# EAGLE design PlacaCalefactora_notUsed (EAGLE 9.6.2)
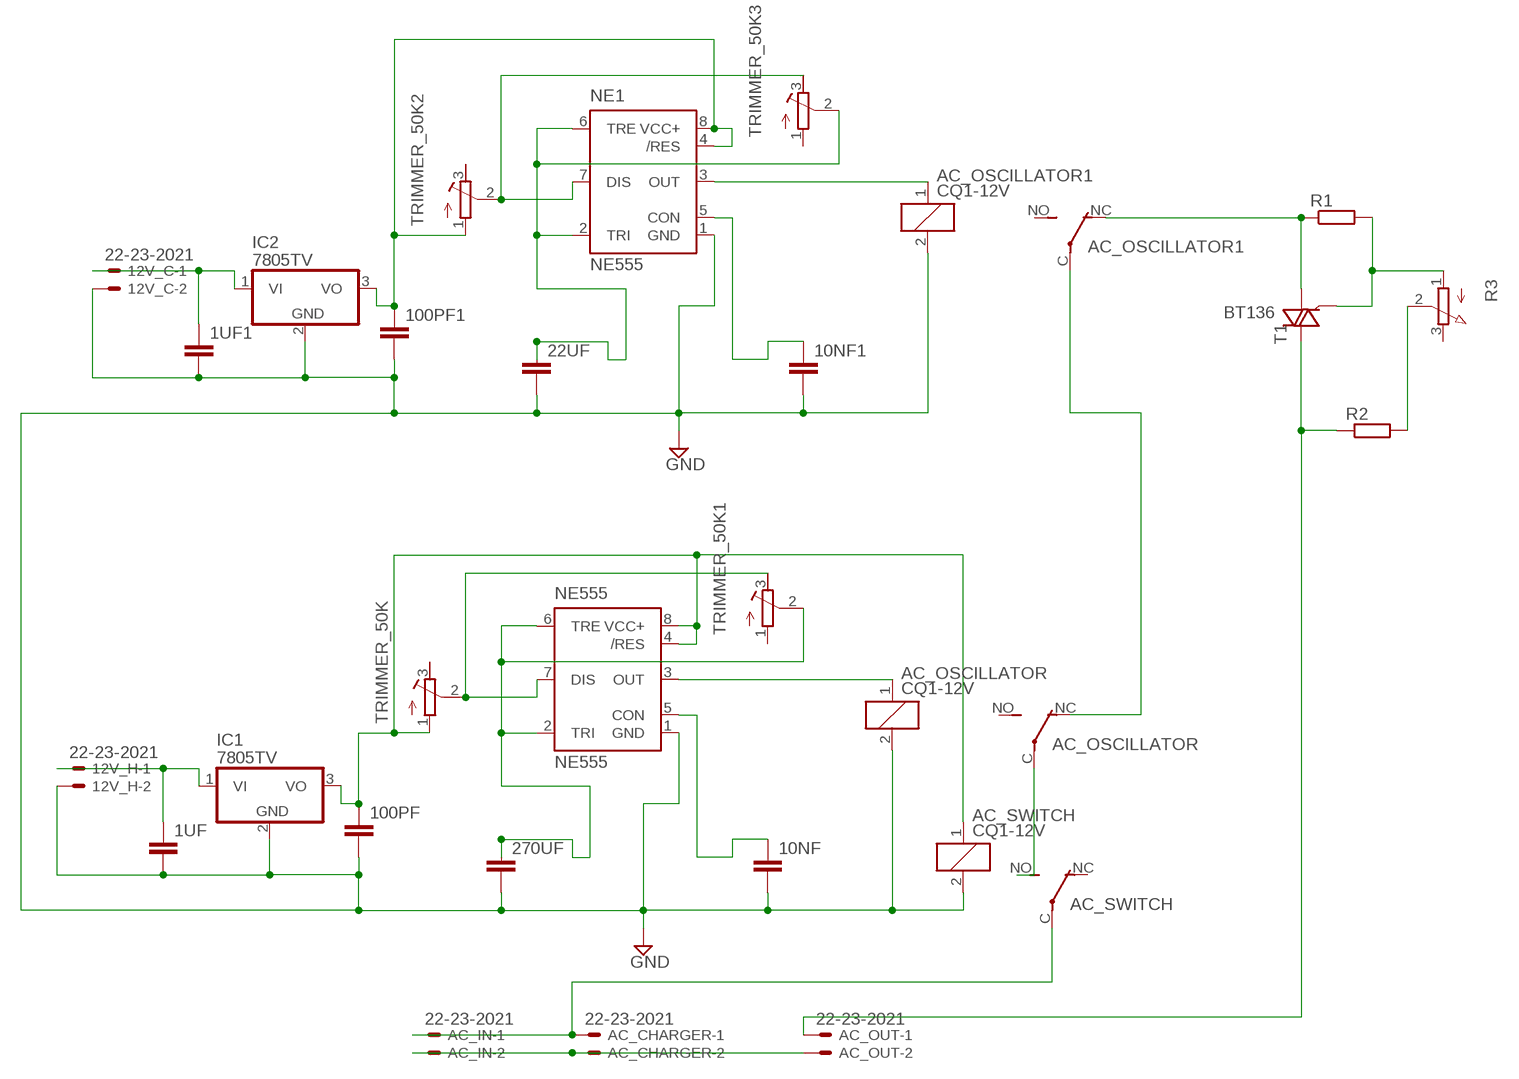
[diagram p0: schematic, sheet 1]

## Parts
1UF  C7.5/3  [C7.5B3]
1UF1  C7.5/3  [C7.5B3]
10NF  C7.5/3  [C7.5B3]
10NF1  C7.5/3  [C7.5B3]
12V_C  22-23-2021  [22-23-2021]
12V_H  22-23-2021  [22-23-2021]
22UF  C7.5/3  [C7.5B3]
100PF  C7.5/3  [C7.5B3]
100PF1  C7.5/3  [C7.5B3]
270UF  C7.5/3  [C7.5B3]
AC_CHARGER  22-23-2021  [22-23-2021]
AC_IN  22-23-2021  [22-23-2021]
AC_OSCILLATOR  CQ1-12V  [CQ1]
AC_OSCILLATOR1  CQ1-12V  [CQ1]
AC_OUT  22-23-2021  [22-23-2021]
AC_SWITCH  CQ1-12V  [CQ1]
IC1  7805TV  [TO220V]
IC2  7805TV  [TO220V]
NE1  NE555  [DIL-08]
NE555  NE555  [DIL-08]
R1  R-EU_0204/7  [0204/7]
R2  R-EU_0204/7  [0204/7]
R3  3RP/1610N  [3RP/1610N]
T1  BT136  [TO220AB]
TRIMMER_50K  R-TRIMM64W  [RTRIM64W]
TRIMMER_50K1  R-TRIMM64W  [RTRIM64W]
TRIMMER_50K2  R-TRIMM64W  [RTRIM64W]
TRIMMER_50K3  R-TRIMM64W  [RTRIM64W]

## Nets
GND: 1UF1.2 1UF.2 10NF1.2 10NF.2 12V_C.2 12V_H.2 22UF.2 100PF1.2 100PF.2 270UF.2 AC_OSCILLATOR1.2 AC_OSCILLATOR.2 AC_SWITCH.2 IC1.2(GND) IC2.2(GND) NE1.1(GND) NE555.1(GND)
N$1: AC_CHARGER.1 AC_IN.1 AC_SWITCH.C(2:P)
N$2: AC_CHARGER.2 AC_IN.2 AC_OUT.2
N$3: 10NF1.1 NE1.5(CON)
N$4: AC_OSCILLATOR.1 NE555.3(OUT)
N$5: 10NF.1 NE555.5(CON)
N$6: NE555.7(DIS) TRIMMER_50K1.3(E) TRIMMER_50K.2(S)
N$7: AC_OSCILLATOR.C(2:P) AC_SWITCH.NO(2:S)
N$8: AC_OSCILLATOR1.C(2:P) AC_OSCILLATOR.NC(2:O)
N$9: 1UF.1 12V_H.1 IC1.1(VI)
N$10: 270UF.1 NE555.2(TRI) NE555.6(TRE) TRIMMER_50K1.2(S)
N$11: R1.2 R3.1(A) T1.3(G)
N$12: AC_OSCILLATOR1.NC(2:O) R1.1 T1.1(A1)
N$13: 100PF.1 AC_SWITCH.1 IC1.3(VO) NE555.4(/RES) NE555.8(VCC+) TRIMMER_50K.1(A)
N$14: 22UF.1 NE1.2(TRI) NE1.6(TRE) TRIMMER_50K3.2(S)
N$15: NE1.7(DIS) TRIMMER_50K2.2(S) TRIMMER_50K3.3(E)
N$16: AC_OSCILLATOR1.1 NE1.3(OUT)
N$17: R2.2 R3.2(S)
N$18: 1UF1.1 12V_C.1 IC2.1(VI)
N$20: AC_OUT.1 R2.1 T1.2(A2)
N$21: 100PF1.1 IC2.3(VO) NE1.4(/RES) NE1.8(VCC+) TRIMMER_50K2.1(A)
Unconnected: AC_OSCILLATOR1.NO(2:S) AC_OSCILLATOR.NO(2:S) AC_SWITCH.NC(2:O) R3.3(E) TRIMMER_50K1.1(A) TRIMMER_50K2.3(E) TRIMMER_50K3.1(A) TRIMMER_50K.3(E)

## Library data of the parts
1UF 1UF1 10NF 10NF1 22UF 100PF 100PF1 270UF = capacitor-wima:C: CAPACITOR naming: grid - package width
12V_C 12V_H AC_CHARGER AC_IN AC_OUT = con-molex:22-23-2021: .100" (2.54mm) Center Header - 2 Pin; MF: MOLEX; MPN: 22-23-2021; OC_FARNELL: 1462926; OC_NEWARK: 25C3832
AC_OSCILLATOR AC_OSCILLATOR1 AC_SWITCH = relay:CQ1-12V: AUTOMOTIVE QUIET RELAY NAiS Source: http://www.mew-europe.com/.. en_ds_61208_0000.pdf; OC_FARNELL: unknown; OC_NEWARK: unknown
IC1 IC2 = linear:78*: Positive VOLTAGE REGULATOR Source: http://cache.national.com/ds/LM/LM78L05.pdf http://www.fairchildsemi.com/ds/LM/LM7805.pdf
NE1 NE555 = st-microelectronics:NE555: General purpose bipolar Timer; MF: Arrow Electronics; MPN: NE555N; OC_FARNELL: 1467742; OC_NEWARK: 89K1486
R1 R2 = rcl:R-EU_: RESISTOR, European symbol; SPICEPREFIX: R
R3 = pot:3RP/1610N: 16mm Potentiometer one level Source: http://www.alphapotentiometers.net/html/16mm_pot_2.html
T1 = triac:BT136: Triac BT136 series E sensitive gate Source: http://www.nxp.com/acrobat_download/datasheets/BT136_SERIES_E_2.pdf
TRIMMER_50K TRIMMER_50K1-TRIMMER_50K3 = rcl:R-TRIMM: Trimm resistor; SPICEMODEL: X; SPICEPREFIXL: POT

## Board
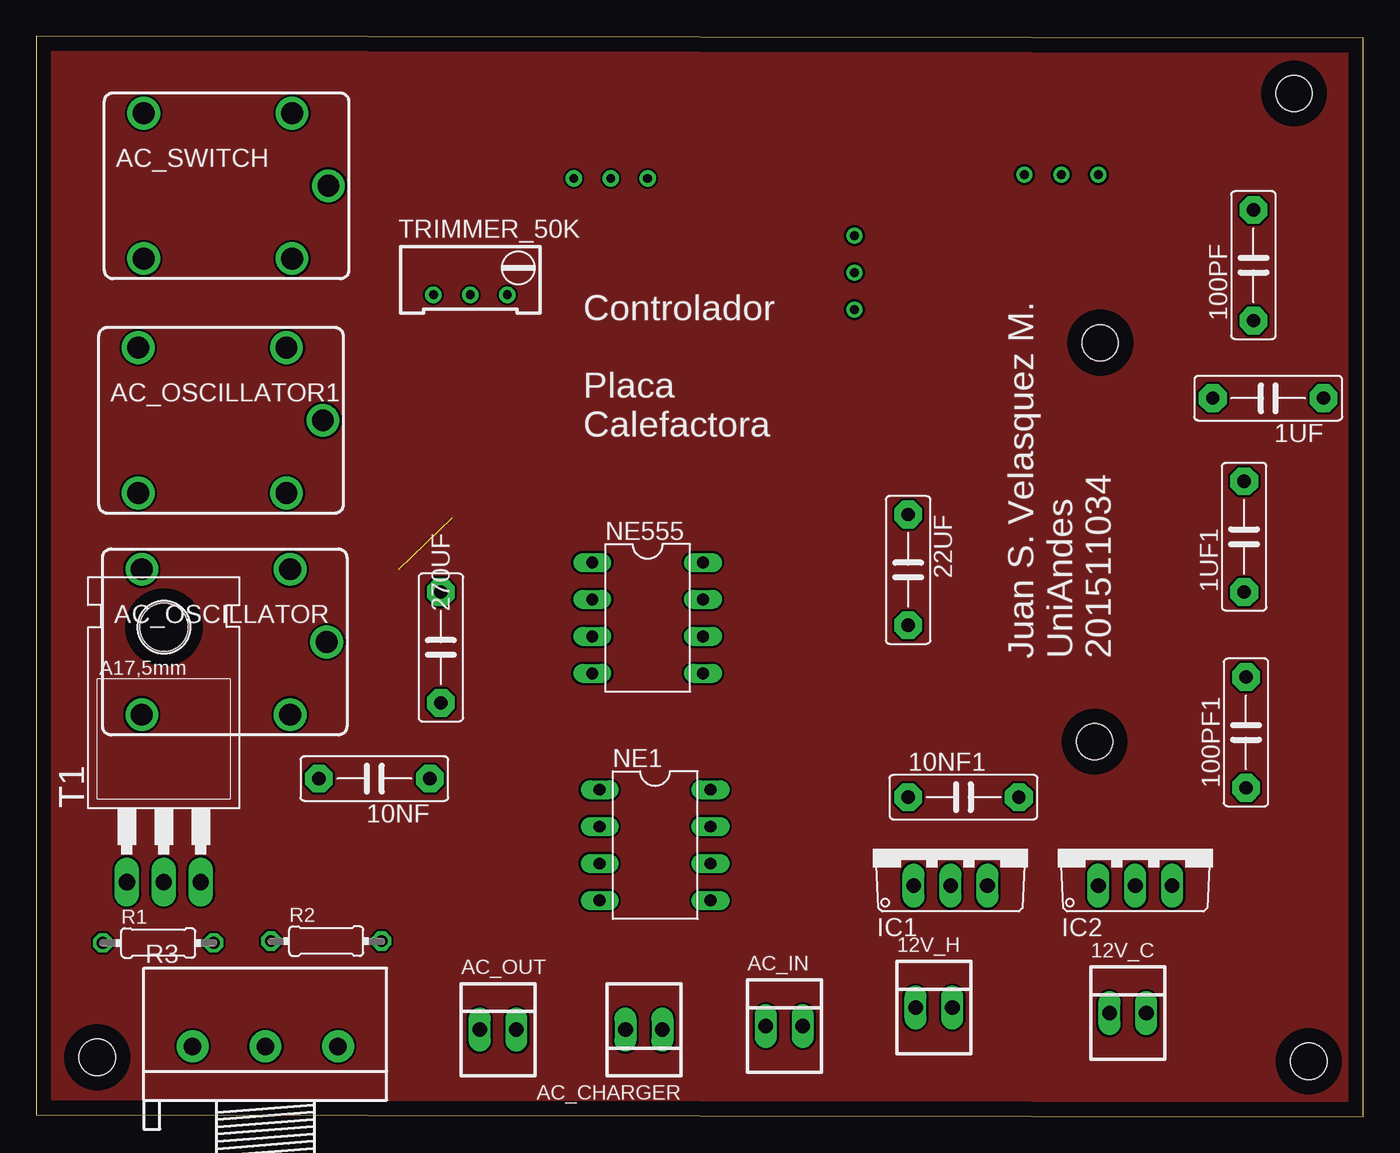
[diagram p1: board, top side]
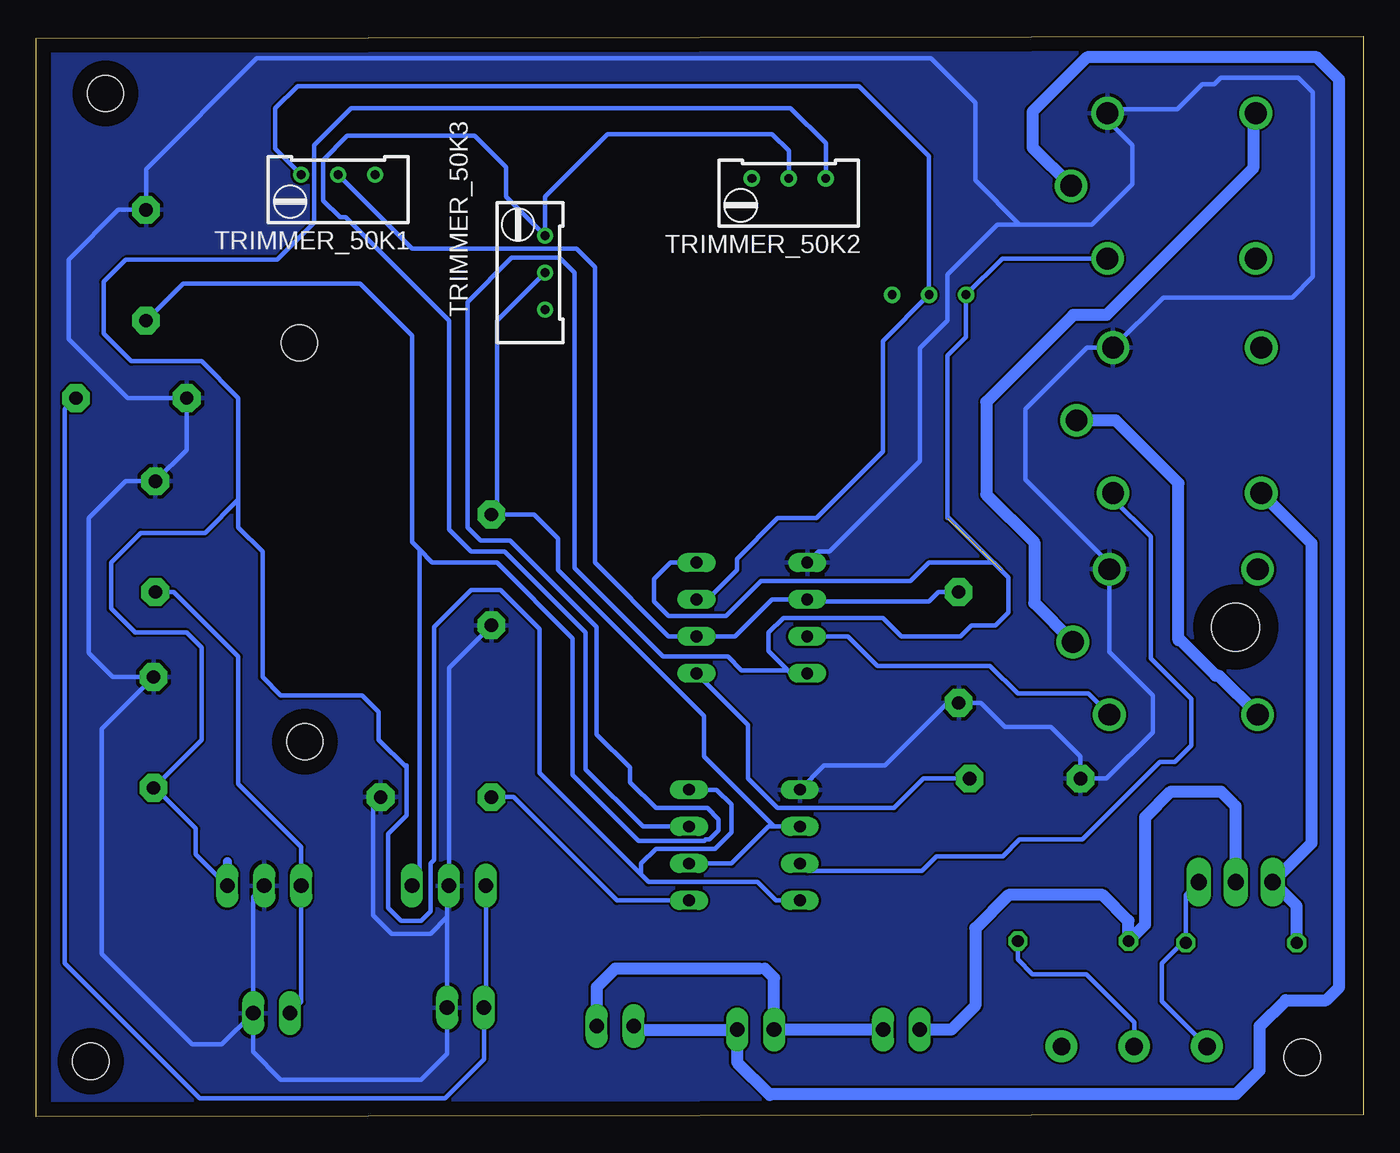
[diagram p2: board, bottom side, seen from below]

Size 91.24 x 74.29 mm. Coordinates in mm from the lower left corner, seen from the top.
Outline: 0,0.13 91.24,0 91.24,74.16 0,74.29 0,0.13
Copper layers (1*16): Top 0.035mm / dielectric 1.5mm / Bottom 0.035mm
Design rules "default": minimum track width 6mil, minimum drill 0.35mm, track to track 6mil, track to pad 6mil, pad to pad 6mil, via to via 6mil, smd to smd 6mil, copper to edge 40mil, drill to drill 6mil, minimum pad ring 10mil, minimum via ring 8mil, stop-mask expansion 4mil, vias tented up to drill 0mil, thermal gap 10mil
Holes 2.5 mm at 86.49,70.36 87.5,3.81 4.19,4.06 72.77,25.78 73.15,53.21

### Footprints (pad centres in the part's own frame; a part is rotated, then mirrored left to right if it is on the bottom)
C7.5B3 = drill 0.914 pad 1.905 octagon: 1 -3.81,0; 2 3.81,0
22-23-2021 = drill 1 long: 1 -1.27,0; 2 1.27,0
CQ1 = drill 1.5: 1 4.5,-5; 2 4.5,5; C 7,0; NC -5.7,-5; NO -5.7,5
TO220V = drill 1.016 long: 1 -2.54,-2.54; 2 0,-2.54; 3 2.54,-2.54
DIL-08 = drill 0.813 long: 1 -3.81,-3.81; 2 -1.27,-3.81; 3 1.27,-3.81; 4 3.81,-3.81; 5 3.81,3.81; 6 1.27,3.81; 7 -1.27,3.81; 8 -3.81,3.81
0204/7 = drill 0.813 octagon: 1 -3.81,0; 2 3.81,0
3RP/1610N = drill 1.2 pad 2.184: 1 -5,0; 2 0,0; 3 5,0
TO220AB = drill 1.118 long: 1 -2.54,-6.35; 2 0,-6.35; 3 2.54,-6.35 | hole 3.302: 0,11.176
RTRIM64W = drill 0.61: 1 1.27,-2.54; 2 1.27,0; 3 1.27,2.54

### Placement (x,y rotation side)
1UF  84.71,49.4 180 top
1UF1  83.06,39.88 90 top
10NF  23.24,23.24 180 top
10NF1  63.75,21.97 0 top
12V_C  75.06,7.11 0 top
12V_H  61.72,7.49 0 top
22UF  59.94,37.59 270 top
100PF  83.69,58.55 90 top
100PF1  83.18,26.42 90 top
270UF  27.81,32.26 270 top
AC_CHARGER  41.78,5.97 180 top
AC_IN  51.44,6.22 0 top
AC_OSCILLATOR  12.95,32.64 0 top
AC_OSCILLATOR1  12.7,47.88 0 top
AC_OUT  31.75,5.97 0 top
AC_SWITCH  13.08,64.01 0 top
IC1  62.87,18.42 0 top
IC2  75.56,18.42 0 top
NE1  42.55,18.67 270 top
NE555  42.04,34.29 270 top
R1  8.38,11.94 0 top
R2  19.94,12.06 0 top
R3  15.75,4.83 0 top
T1  8.76,22.48 0 top
TRIMMER_50K  29.84,57.78 270 top
TRIMMER_50K1  70.48,63.5 90 bottom
TRIMMER_50K2  39.5,63.25 90 bottom
TRIMMER_50K3  57.53,58.04 0 bottom

### Tracks (layer width: path | path; a pad name or v marks a point on that pad's centre or on a via)
CORTE
  pour Top: 0,74.3 91.19,74.3 91.19,0 0,0
GND
  Bottom 0.305: 23.62,61.34 18.67,61.34 15.88,64.14 15.88,66.8 17.58,68.51 AC_SWITCH.2 17.31,69.28 12.76,69.28 11.05,70.99 10.22,70.99 9.77,71.44 4.44,71.44 3.47,70.46 3.47,57.75 4.89,56.32 13.75,56.32 AC_OSCILLATOR1.2 19,52.88 23.24,48.64 23.24,43.81 17.45,38.03 AC_OSCILLATOR.2 17.45,31.93 14.48,28.96 14.48,26.42 17.65,23.24 10NF.2 19.43,24.77 21.46,26.8 24.64,26.8 26.29,28.45 270UF.2 28.57,28.45 32.89,24.13 37.08,24.13 NE1.1 | 23.62,61.34 25.15,61.34 28.57,57.91 28.57,54.74 30.48,52.83 30.48,45.09 36.7,38.86 37.47,38.86 NE555.1 | 23.62,61.34 26.67,64.39 26.67,69.72 29.72,72.77 76.07,72.77 83.69,65.15 100PF.2 85.6,62.36 89.03,58.93 89.03,53.47 84.96,49.4 1UF.2 80.9,45.85 1UF1.2 85.09,43.69 87.63,41.15 87.63,31.88 85.98,30.23 100PF1.2 86.74,26.67 86.74,11.18 80.52,4.95 78.49,4.95 12V_C.2 | 22UF.2 62.87,30.86 IC1.2 62.99,15.75 62.99,13.72 | 62.99,13.72 64.13,12.57 66.8,12.57 68.07,13.84 68.07,21.46 10NF1.2 | 62.99,13.72 12V_H.2 62.99,4.32 64.77,2.54 74.42,2.54 76.33,4.45 12V_C.2 | 12V_C.2 76.33,15.11 IC2.2
  Bottom 0.61: 270UF.2 27.56,28.7
  pour Bottom: -1.02,75.31 91.82,75.31 91.82,-0.51 91.69,-0.64 -1.02,-0.64 -1.14,-0.51 -1.14,75.18
N$1
  Bottom 0.813: AC_IN.1 49.91,5.97 AC_CHARGER.1 43.05,3.74 40.87,1.56 | 40.87,1.56 40.8,1.49 | 40.87,1.56 8.73,1.56 7.11,3.17 7.11,6.22 5.33,8 2.54,8 1.65,8.89 1.65,71.31 3.17,72.83 18.99,72.83 22.73,69.09 22.73,66.66 AC_SWITCH.C
N$2
  Bottom 0.61: 41.15,10.16 41.53,10.16
  Bottom 0.813: 41.15,10.16 40.51,9.52 AC_CHARGER.2 AC_OUT.2 | 41.53,10.16 51.44,10.16 52.71,8.89 AC_IN.2
N$3
  Bottom 0.305: NE1.5 51.31,14.86 58.42,21.97 10NF1.1
N$4
  Bottom 0.305: AC_OSCILLATOR.1 18.9,29.08 23.75,29.08 25.65,30.99 33.4,30.99 35.43,33.02 NE555.3
N$5
  Bottom 0.305: 10NF.1 30.23,23.24 32.26,21.21 40.26,21.21 42.29,23.24 42.29,26.92 NE555.5
N$6
  Bottom 0.305: NE555.7 45.09,35.56 43.05,37.59 43.05,38.35 40.26,41.15 37.59,41.15 33.02,45.72 33.02,53.34 TRIMMER_50K.2 29.84,66.04 34.67,70.87 73.28,70.87 74.8,69.34 74.8,66.55 TRIMMER_50K1.3
N$7
  Bottom 0.813: AC_SWITCH.NO 7.56,68.83 7.56,65.21 17.65,55.12 19.94,55.12 25.91,49.15 25.91,42.78 22.62,39.5 22.62,35.31 AC_OSCILLATOR.C
N$8
  Bottom 0.813: AC_OSCILLATOR.NC 9.94,30.33 10.14,30.33 12.58,32.77 12.7,32.77 12.7,43.56 17.02,47.88 17.27,47.88 AC_OSCILLATOR1.C
N$9
  Bottom 0.305: IC1.1 60.33,7.62 12V_H.1 60.45,3.94 63.12,1.27 80.01,1.27 89.28,10.54 89.28,48.64 1UF.1
N$10
  Bottom 0.305: 270UF.1 29.21,36.07 29.84,35.43 38.1,35.43 NE555.2 40.64,35.56 43.18,33.02 NE555.6 47.75,33.02 52.83,38.1 52.83,58.42 54.1,59.69 65.41,59.69 TRIMMER_50K1.2
N$11
  Bottom 0.305: T1.3 12.19,15.24 R1.2 12.45,11.94 13.84,10.54 13.84,7.92 R3.1
  Bottom 0.406: 12.32,11.81 R1.2
N$12
  Bottom 0.813: R1.1 4.57,14.48 T1.1 3.56,18.8 3.56,39.43 AC_OSCILLATOR1.NC
N$13  (1 unrouted)
  Bottom 0.305: AC_SWITCH.1 24.81,59.01 TRIMMER_50K.1 27.3,53.59 28.57,52.32 28.57,41.27 | 28.57,41.27 28.57,41.15 | 28.57,41.27 24.38,37.08 24.38,34.67 25.27,33.78 26.92,33.78 27.69,33.02 31.75,33.02 33.02,34.29 39.88,34.29 40.89,33.27 40.89,32 39.56,30.67 | NE555.4 39.37,30.48 39.56,30.67 | 24.89,37.59 25.4,38.1 29.84,38.1 31.11,36.83 41.4,36.83 43.82,34.42 47.75,34.42 48.77,35.43 48.77,36.96 47.62,38.1 NE555.8 | 39.56,30.67 42.73,30.67 43.69,31.62 48.13,31.62 54.23,37.72 54.23,58.04 55.25,59.05 58.55,59.05 61.59,56.01 61.59,40.51 60.71,39.62 58.67,39.62 52.71,33.65 52.71,26.29 50.42,24 50.42,22.99 48.64,21.21 45.09,21.21 44.32,20.45 44.32,19.69 44.96,19.05 45.22,19.05 45.3,18.97 49.84,18.97 54.36,23.5 54.36,32.89 59.56,38.1 64.01,38.1 64.9,38.99 | IC1.3 64.9,16.38 64.9,38.99 | 100PF.1 81.15,57.28 68.96,57.28 65.41,53.72 65.41,39.5 64.9,38.99
N$14
  Bottom 0.305: NE1.6 43.43,17.4 40.89,19.94 NE1.2 40.51,19.94 45.34,24.77 45.34,27.56 55.37,37.59 55.37,39.75 57.02,41.4 22UF.1 59.56,41.78 59.56,54.74 TRIMMER_50K3.2
N$15
  Bottom 0.305: TRIMMER_50K2.2 39.5,66.42 40.64,67.56 51.94,67.56 56.26,63.25 TRIMMER_50K3.3 58.93,63.25 58.93,65.28 61.09,67.44 69.85,67.44 71.5,65.79 71.5,62.99 70.36,61.85 69.98,61.85 62.87,54.74 62.87,40.39 61.34,38.86 59.05,38.86 53.47,33.27 53.47,23.88 49.53,19.94 NE1.7
  Bottom 0.61: NE1.7 46.48,19.81
N$16
  Bottom 0.305: AC_OSCILLATOR1.1 17.2,42.47 14.61,39.88 14.61,31.5 11.81,28.7 11.81,25.53 12.95,24.38 13.97,24.38 19.3,19.05 23.62,19.05 24.76,17.91 29.34,17.91 30.35,16.89 38.23,16.89 NE1.3
N$17
  Bottom 0.305: R3.2 15.75,6.48 19.05,9.78 22.73,9.78 23.75,10.79 R2.2
N$18
  Bottom 0.305: 12V_C.1 73.02,7.87 IC2.1 73.02,18.54 77.34,22.86 77.34,31.62 81.79,36.07 1UF1.1
N$20
  Bottom 0.61: 8.76,21.34 9.02,21.59
  Bottom 0.813: AC_OUT.1 28.32,5.97 26.67,7.62 26.67,12.95 24.38,15.24 17.91,15.24 16.13,13.46 R2.1 14.99,13.21 14.99,20.57 13.21,22.35 9.78,22.35 9.02,21.59 | T1.2 8.76,21.34
N$21
  Bottom 0.305: 49.66,16.64 49.15,16.13 41.66,16.13 40.39,14.86 NE1.4 | 49.66,16.64 49.66,17.4 48.64,18.42 44.58,18.42 43.43,19.56 43.43,21.46 44.45,22.48 NE1.8 | TRIMMER_50K2.1 36.96,66.93 39.37,69.34 69.6,69.34 72.14,66.8 72.14,61.47 74.68,58.93 85.09,58.93 86.61,57.4 86.61,53.85 84.71,51.94 79.88,51.94 77.34,49.4 77.34,42.42 | IC2.3 80.26,18.03 80.26,19.81 83.06,22.61 100PF1.1 79.88,25.91 79.88,32.26 80.9,33.27 84.45,33.27 86.11,34.92 86.11,38.1 84.07,40.13 79.63,40.13 77.34,42.42 | 49.66,16.64 56.64,23.62 56.64,33.53 59.31,36.2 61.34,36.2 63.88,33.65 63.88,17.65 64.13,17.4 64.13,14.1 64.77,13.46 66.17,13.46 67.06,14.35 67.06,19.43 65.79,20.7 65.79,24 | 65.79,24 65.79,24.13 | 65.79,24 67.69,25.91 67.69,27.81 68.83,28.96 74.42,28.96 75.69,30.23 75.69,38.86 77.34,40.51 77.34,42.42
  Bottom 0.61: 78.1,17.53 IC2.3

### Text on the board
tPlace: Controlador / / Placa / Calefactora | Juan S. Velasquez M. / UniAndes / 201511034